# Altium schematic sheet APP_1_Connectors_e.SchDoc
size Tabloid; DocumentNumber: 3; SheetNumber: 3; SheetTotal: 12; Sheet_Name: Connectors; Size: 11x17
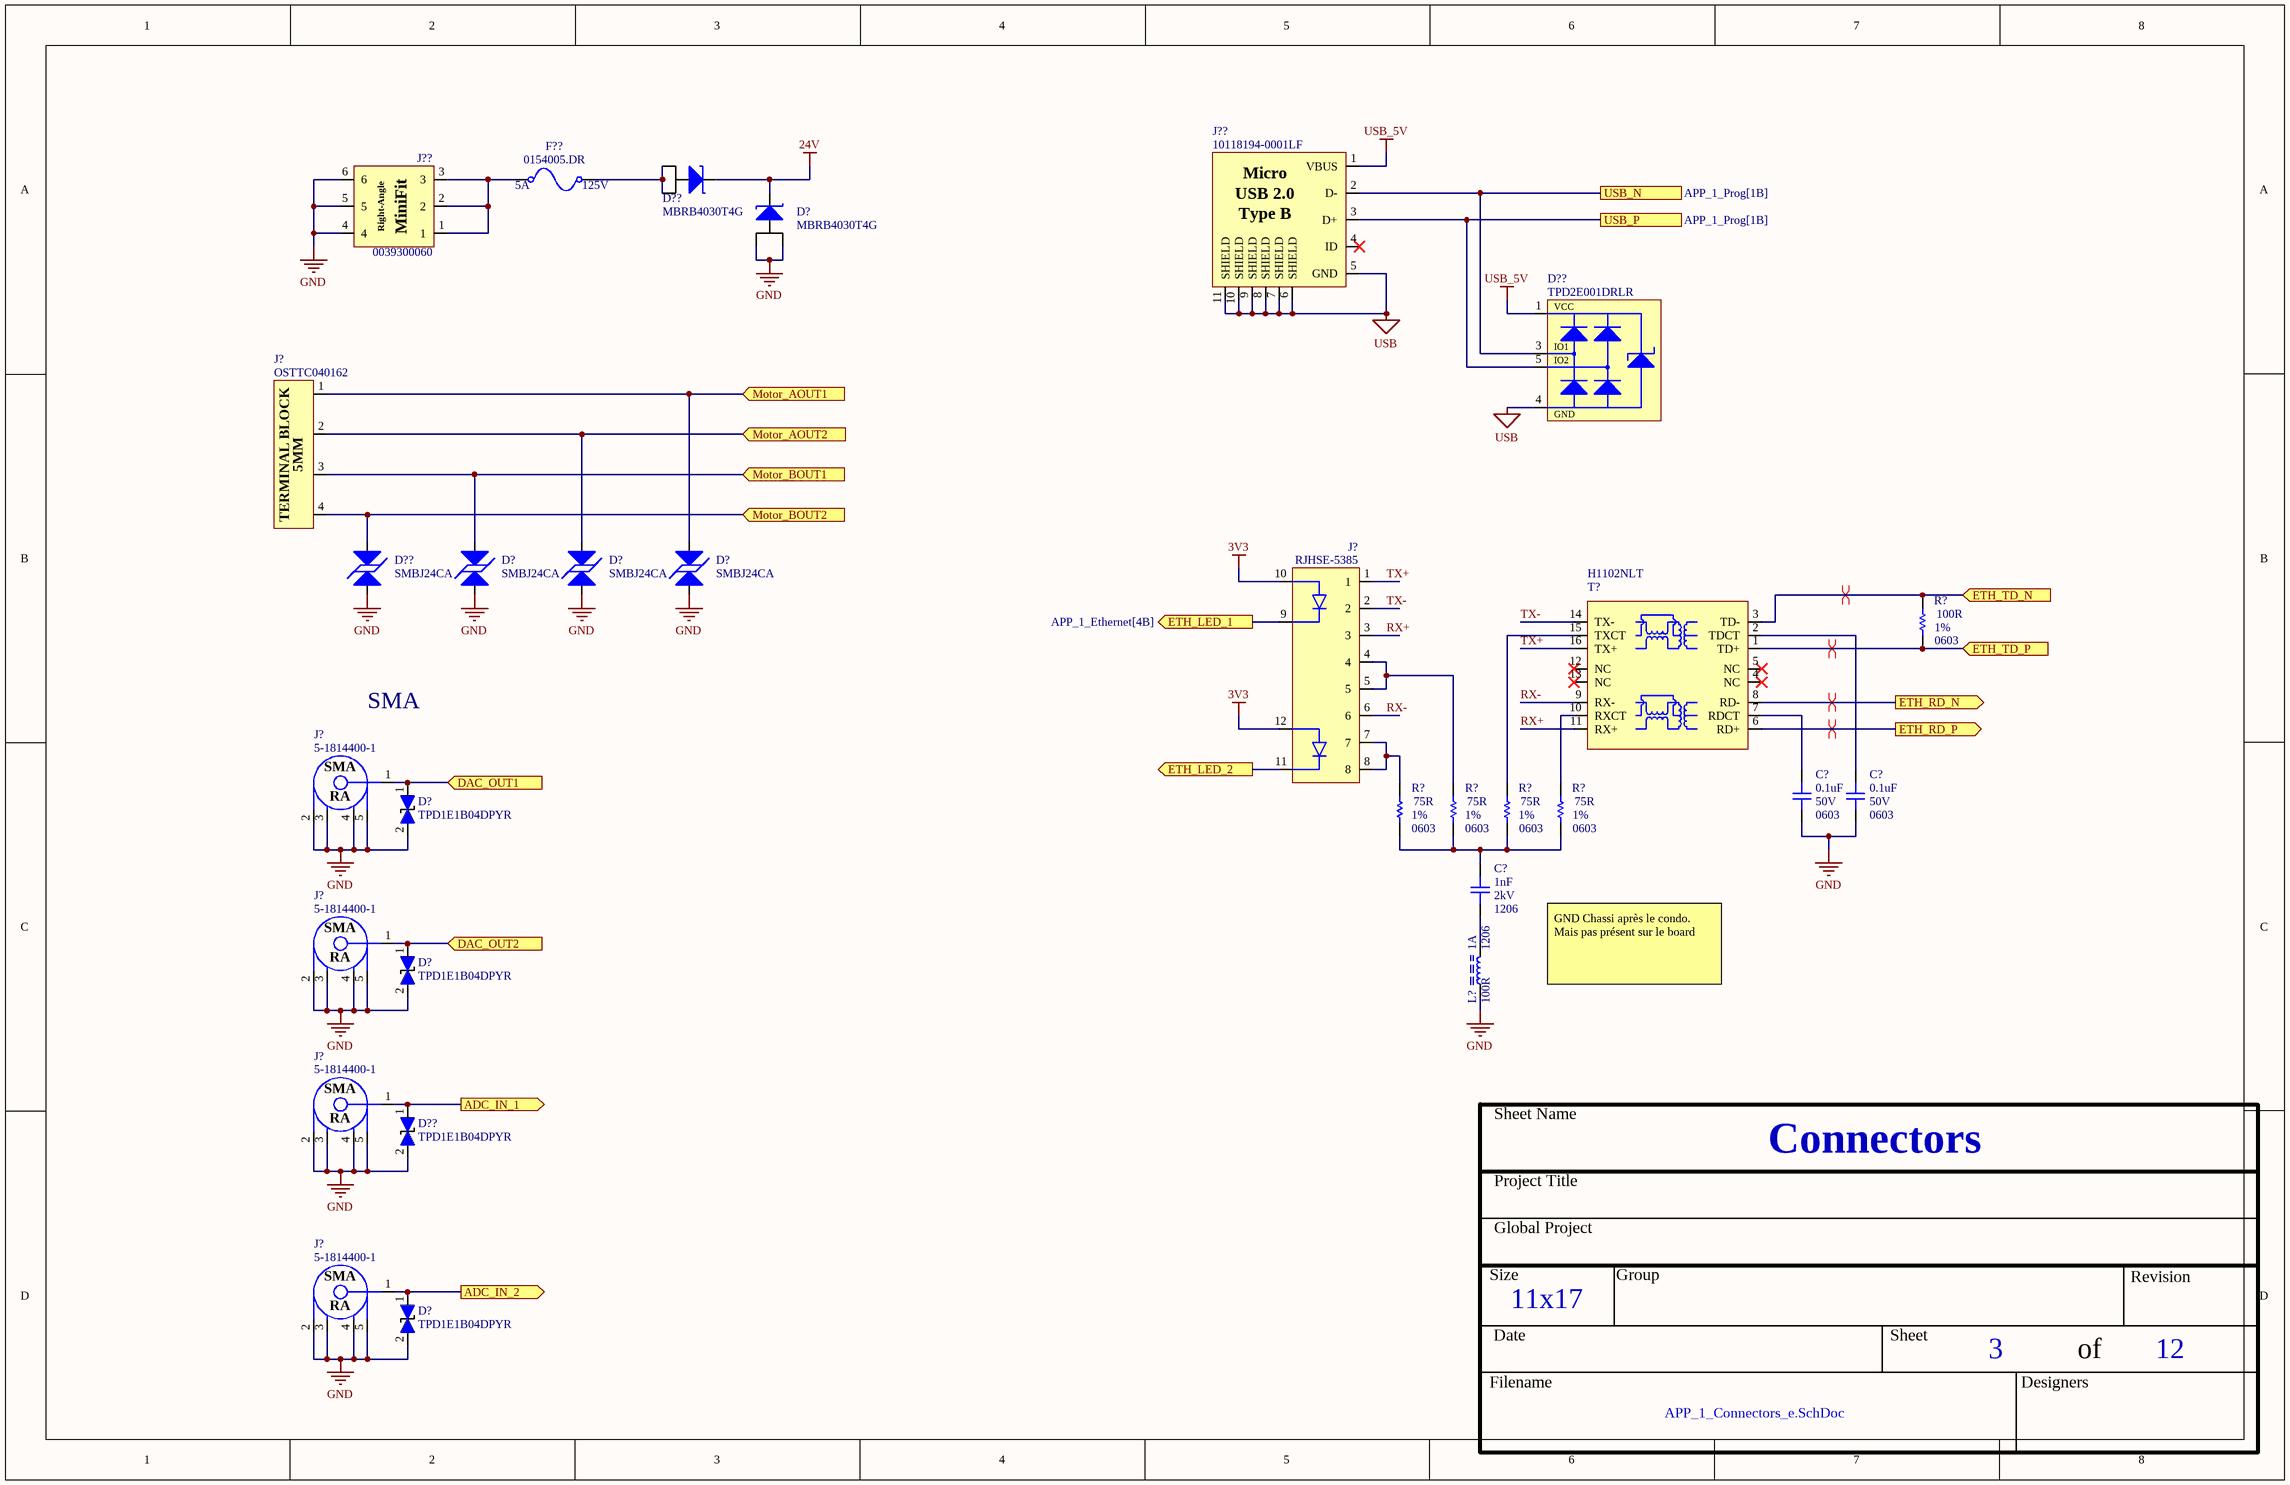
[diagram p0: APP_1_Connectors_e.SchDoc]

## Parts
(Parts that share a designator on the sheet are numbered #1, #2 ... from top to bottom, then left to right.)
C?#1  value 0.1uF  Voltage: 50V  Package: 0603  [CAP_0603]  (hidden comment: CAP - 0603)
C?#2  value 0.1uF  Voltage: 50V  Package: 0603  [CAP_0603]  (hidden comment: CAP - 0603)
C?#3  value 1nF  Voltage: 2kV  Package: 1206  [CAP_1206]  (hidden comment: CAP - 1206)
D?#1  MBRB4030T4G  [DIO_SCHOTTKY_MBRB4030T4G]
D?#2  SMBJ24CA  [TVS_PWR_SMBJ36CA]
D?#3  SMBJ24CA  [TVS_PWR_SMBJ36CA]
D?#4  SMBJ24CA  [TVS_PWR_SMBJ36CA]
D?#5  TPD1E1B04DPYR  [TVS_DATA_TPD1E1B04DPYR]
D?#6  TPD1E1B04DPYR  [TVS_DATA_TPD1E1B04DPYR]
D?#7  TPD1E1B04DPYR  [TVS_DATA_TPD1E1B04DPYR]
D??#1  MBRB4030T4G  [DIO_SCHOTTKY_MBRB4030T4G]
D??#2  TPD2E001DRLR  [TVS_USB_TPD2E001DRLR]
D??#3  SMBJ24CA  [TVS_PWR_SMBJ36CA]
D??#4  TPD1E1B04DPYR  [TVS_DATA_TPD1E1B04DPYR]
F??  0154005.DR  Voltage Rating: 125V  Current Rating: 5A  [FUS_0154XXX.DR]
J?#1  OSTTC040162  [CONN_TERMINAL_OSTTA040161]
J?#2  RJHSE-5385  [CONN_ETHERNET_RJHSE-5385]
J?#3  5-1814400-1  [CONN_SMA_5-1814400-1]
J?#4  5-1814400-1  [CONN_SMA_5-1814400-1]
J?#5  5-1814400-1  [CONN_SMA_5-1814400-1]
J?#6  5-1814400-1  [CONN_SMA_5-1814400-1]
J??#1  10118194-0001LF  [CON_USB_10118194-0001LF]
J??#2  0039300060  [CON_MINIFIT_0039300060]
L?  value 100R  Current: 1A  Package: 1206  [FER_1206]  (hidden comment: FER - 1206)
R?#1  value 100R  Package: 0603  Precision: 1%  [RES_0603]  (hidden comment: RES - 0603)
R?#2  value 75R  Package: 0603  Precision: 1%  [RES_0603]  (hidden comment: RES - 0603)
R?#3  value 75R  Package: 0603  Precision: 1%  [RES_0603]  (hidden comment: RES - 0603)
R?#4  value 75R  Package: 0603  Precision: 1%  [RES_0603]  (hidden comment: RES - 0603)
R?#5  value 75R  Package: 0603  Precision: 1%  [RES_0603]  (hidden comment: RES - 0603)
T?  H1102NLT  [TRANSFO_H1102NLT]

## Ports
ADC_IN_1 (out, see APP_1_ADC[1A]), ADC_IN_2 (out, see APP_1_ADC[1B]), DAC_OUT1 (in, see APP_1_DAC[5A]), DAC_OUT2 (in, see APP_1_DAC[5B]), ETH_LED_1 (out, see APP_1_Ethernet[4B]), ETH_LED_2 (out), ETH_RD_N (out, see APP_1_Ethernet[4B]), ETH_RD_P (out, see APP_1_Ethernet[4A]), ETH_TD_N (in, see APP_1_Ethernet[4A]), ETH_TD_P (in, see APP_1_Ethernet[4A]), Motor_AOUT1 (in, see APP_1_Stepper[5A]), Motor_AOUT2 (in, see APP_1_Stepper[5B]), Motor_BOUT1 (in, see APP_1_Stepper[5B]), Motor_BOUT2 (in, see APP_1_Stepper[5B]), USB_N (see APP_1_Prog[1B]), USB_P (see APP_1_Prog[1B])

## Nets
3V3: J?#2.10(LED1_A) J?#2.12(LED2_A)
24V: D?#1.4 D??#1.4
GND: C?#1.1 C?#2.1 D?#1.1(A) D?#1.3 D?#2.2 D?#3.2 D?#4.2 D?#5.2(i/o) D?#6.2(i/o) D?#7.2(i/o) D??#3.2 D??#4.2(i/o) J?#3.2 J?#3.3 J?#3.4 J?#3.5 J?#4.2 J?#4.3 J?#4.4 J?#4.5 J?#5.2 J?#5.3 J?#5.4 J?#5.5 J?#6.2 J?#6.3 J?#6.4 J?#6.5 J??#2.4 J??#2.5 J??#2.6 L?.2
USB: D??#2.4(GND) J??#1.5(GND) J??#1.6(SHIELD) J??#1.7(SHIELD) J??#1.8(SHIELD) J??#1.9(SHIELD) J??#1.10(SHIELD) J??#1.11(SHIELD)
USB_5V: D??#2.1(VCC) J??#1.1(VBUS)
ADC_IN_1: D??#4.1(i/o) J?#5.1 ; port ADC_IN_1
ADC_IN_2: D?#7.1(i/o) J?#6.1 ; port ADC_IN_2
DAC_OUT1: D?#5.1(i/o) J?#3.1 ; port DAC_OUT1
DAC_OUT2: D?#6.1(i/o) J?#4.1 ; port DAC_OUT2
ETH_LED_1: J?#2.9(LED1_K) ; port ETH_LED_1
ETH_LED_2: J?#2.11(LED2_K) ; port ETH_LED_2
ETH_RD_N: T?.8(RD-) ; port ETH_RD_N
ETH_RD_P: T?.6(RD+) ; port ETH_RD_P
ETH_TD_N: R?#1.2 T?.3(TD-) ; port ETH_TD_N
ETH_TD_P: R?#1.1 T?.1(TD+) ; port ETH_TD_P
Motor_AOUT1: D?#4.1 J?#1.1 ; port Motor_AOUT1
Motor_AOUT2: D?#3.1 J?#1.2 ; port Motor_AOUT2
Motor_BOUT1: D?#2.1 J?#1.3 ; port Motor_BOUT1
Motor_BOUT2: D??#3.1 J?#1.4 ; port Motor_BOUT2
RX+: J?#2.3 T?.11(RX+)
RX-: J?#2.6 T?.9(RX-)
TX+: J?#2.1 T?.16(TX+)
TX-: J?#2.2 T?.14(TX-)
USB_N: D??#2.3(IO1) J??#1.2(D-) ; port USB_N
USB_P: D??#2.5(IO2) J??#1.3(D+) ; port USB_P
NetC?#1_2: C?#1.2 T?.7(RDCT)
NetC?#2_2: C?#2.2 T?.2(TDCT)
NetC?#3_1: C?#3.1 L?.1
NetC?#3_2: C?#3.2 R?#2.1 R?#3.1 R?#4.1 R?#5.1
NetD??#1_1: D??#1.1(A) D??#1.3 F??.2
NetF??_1: F??.1 J??#2.1 J??#2.2 J??#2.3
NetJ?#2_4: J?#2.4 J?#2.5 R?#3.2
NetJ?#2_7: J?#2.7 J?#2.8 R?#2.2
NetR?#4_2: R?#4.2 T?.15(TXCT)
NetR?#5_2: R?#5.2 T?.10(RXCT)

Not connected (* = marked no-connect by the designer): D??#2 2(NC); J??#1 4(ID)*; T? 4(NC)* 5(NC)* 12(NC)* 13(NC)*

## Layout directives
differential pair: ETH_RD_N, ETH_RD_P, ETH_TD_N, ETH_TD_P

## Notes on the sheet
- SMA
- GND Chassi après le condo. Mais pas présent sur le board
- Sheet Name
- Project Title
- Global Project
- Size
- Group
- Revision
- Date
- Sheet
- of
- Filename
- Designers
- (in symbol CON_MINIFIT_0039300060) Right-Angle; MiniFit
- (in symbol CON_USB_10118194-0001LF) Micro; USB 2.0; Type B
- (in symbol CONN_SMA_5-1814400-1) SMA; RA
- (in symbol CONN_TERMINAL_OSTTC040162) TERMINAL BLOCK; 5MM

## Library data of the parts
C?#1 C?#2 = CAP - 0603: Precision: 10%; Current: *; CreatedBy: Jonathan Bouchard; Power: *
C?#3 = CAP - 1206: Precision: 10%; Current: *; CreatedBy: Jonathan Bouchard; Power: *
D?#1 D??#1 = DIO_SCHOTTKY_MBRB4030T4G: DIO - 30V MAX 40 A - TO-263-3; Manufacturer #1: ON Semiconductor; Value: Vf = 550mV @ 40A; Current Rating: 40A; GRAMS Lib Spec: 2.8; Magnetic Material: NO; Polarized: Yes; Cryo: UNKNOWN; Tolerance: *; Voltage Rating: 30V; Power Max: *; HelpURL: http://www.onsemi.com/pub/Collateral/MBRB4030-D.PDF; CreatedBy/Date: Arnaud Samson - 06/07/18; VerifiedBy: Jonathan Bouchard 2018-07-12; Temperature: -65°C ~ 175°C; Package: D2PAK; Manufacturer #2: *; Note: *; Assembly Type: SMD; Part Number #2: *; Part Number #1: MBRB4030T4G; Supplier 1: Digi-Key; Supplier Part Number 1: MBRB4030T4GOSCT-ND
D?#2-D?#4 D??#3 = TVS_PWR_SMBJ24CA: TVS - 24V 26.7V 600W - DO214AA; Manufacturer #1: Littelfuse Inc.; Value: Vbr = 26.7V -  Clamp = 38.9V; Voltage Rating: 24V Standoff; Current Rating: 15.5A; GRAMS Lib Spec: 2.8; Magnetic Material: UNKNOWN; Polarized: NO; Tolerance: *; Power Max: 600W; HelpURL: http://www.littelfuse.com/~/media/electronics/datasheets/tvs_diodes/littelfuse_tvs_diode_smbj_datasheet.pdf.pdf; CreatedBy/Date: Arnaud Samson - 06/07/18; VerifiedBy: Jonathan Bouchard - 2018-07-13; Temperature: -65°C ~ 150°C (TJ); Package: DO214AA; Manufacturer #2: *; Note: *; Assembly Type: SMD; Part Number #2: *; Part Number #1: SMBJ24CA; Supplier 1: Digi-Key; Supplier Part Number 1: SMBJ24CALFCT-ND; Cryo: UNKNOWN
D?#5-D?#7 D??#4 = TVS_DATA_TPD1E1B04DPYR: TVS - TVS DIODE 3.6V 8.5V - 0402; Manufacturer #1: Texas Instruments; Current Rating: 6.3Apeak; Power Max: 50Wpeak; GRAMS Lib Spec: 2.8; Magnetic Material: Unknown; Polarized: No; Value: *; Tolerance: *; Voltage Rating: 3.6V; HelpURL: http://www.ti.com/lit/ds/symlink/tpd1e1b04.pdf; CreatedBy/Date: Keven Deslandes - 2018/10/19; VerifiedBy: Caroline Paulin - 28 janv 2019; Temperature: -40°C ~ 125°C (TA); Package: 0402; Manufacturer #2: *; Note: *; Assembly Type: SMD; Part Number #2: *; Part Number #1: TPD1E1B04DPYR; Supplier 1: Digi-Key; Supplier Part Number 1: 296-47364-1-ND; Cryo: UNKNOWN
D??#2 = TVS_USB_TPD2E001DRLR: TVS - USB TVS DIODE 5.5V - SOT-553; Manufacturer #1: Texas Instruments; Value: 11V Breakdown; Voltage Rating: 5.5V (Max); GRAMS Lib Spec: 2.8; Magnetic Material: YES; Cryo: UNKNOWN; Tolerance: *; Current Rating: *; Power Max: *; HelpURL: http://www.ti.com/lit/ds/symlink/tpd2e001.pdf; CreatedBy/Date: Jonathan Bouchard 2018-07-10; VerifiedBy: Arnaud Samson 16-07-18; Temperature: -40°C ~ 85°C (TA); Package: SOT-553; Manufacturer #2: *; Note: *; Assembly Type: SMD; Part Number #2: *; Part Number #1: TPD2E001DRLR; Polarized: YES; Supplier 1: Digi-Key; Supplier Part Number 1: 296-21883-1-ND
F?? = FUS_0154005.DR: FUS - 5 A 125 VAC/VDC - 2-SMD; Manufacturer #1: Littelfuse Inc.; Value: 5A 125V AC/DC FAST; GRAMS Lib Spec: 2.8; Magnetic Material: UNKNOWN; Polarized: NO; Tolerance: *; Power Max: *; HelpURL: http://www.littelfuse.com/~/media/electronics/datasheets/fuses/littelfuse_fuse_154_154t_154l_154tl_datasheet.pdf.pdf; CreatedBy/Date: Arnaud Samson - 06/07/18; VerifiedBy: Jonathan Bouchard 2018-07-16; Temperature: -55°C ~ 125°C; Package: 2-SMD; Manufacturer #2: *; Note: *; Assembly Type: SMD; Part Number #2: *; Part Number #1: 0154005.DR; Supplier 1: Digi-Key; Supplier Part Number 1: F1228CT-ND; Cryo: UNKNOWN
J?#1 = CONN_TERMINAL_OSTTC040162: CONN -  TERMINAL BLOCK 4POS 5MM - TH; Mfg: On Shore Technology Inc.; Voltage: *; Current: *; Power: *; Mfg Part Number: OSTTC040162; HelpURL: http://www.on-shore.com/wp-content/uploads/2015/09/osttcxx0162.pdf; CreatedBy: Jonathan Bouchard; Temperature: -30°C ~ 105°C; Value: *; Precision: *; Package: TH-4; Supplier 1: Digikey; Supplier Part Number 1: ED2602-ND
J?#2 = CONN_ETHERNET_RJHSE-5385: CONN - MOD JACK RJ45 R/A ETHERNET - TH; Mfg: Amphenol; Voltage: *; Current: *; Power: *; Mfg Part Number: RJHSE-5385; HelpURL: https://www.amphenolcanada.com/ProductSearch/drawings/AC/RJHSE538X.pdf; CreatedBy: Jonathan Bouchard; Temperature: -55°C ~ 85°C; Value: *; Precision: *; Package: TH-12; Supplier 1: Digikey; Supplier Part Number 1: RJHSE-5385-ND
J?#3-J?#6 = CONN_SMA_5-1814400-1: CONN -  SMA JACK R/A 50 OHM - TH; Mfg: TE Connectivity AMP Connectors; Voltage: *; Current: *; Power: *; Mfg Part Number: 5-1814400-1; HelpURL: http://www.te.com/commerce/DocumentDelivery/DDEController?Action=srchrtrv&DocNm=1814400&DocType=Customer+Drawing&DocLang=English; CreatedBy: Jonathan Bouchard; Temperature: -55°C ~ 85°C; Value: *; Precision: *; Package: TH-5; Supplier 1: Digikey; Supplier Part Number 1: A97593-ND
J??#1 = CON_USB_10118194-0001LF: CON - USB MICRO B RECPT SMT R/A - 4PIN; Manufacturer #1: Amphenol FCI; Value: USB - Micro B; Voltage Rating: 100VAC; Current Rating: 1.8A; GRAMS Lib Spec: 2.8; Magnetic Material: YES; Cryo: UNKNOWN; Tolerance: *; Power Max: *; HelpURL: https://cdn.amphenol-icc.com/media/wysiwyg/files/drawing/10118194.pdf; CreatedBy/Date: Arnaud Samson - 09/07/18; VerifiedBy: Jonathan Bouchard 2018-07-12; Temperature: -30°C ~ 80°C; Package: 5-SMD; Manufacturer #2: *; Note: *; Assembly Type: SMD; Part Number #2: *; Part Number #1: 10118194-0001LF; Polarized: YES; Supplier 1: Digi-Key; Supplier Part Number 1: 609-4618-1-ND
J??#2 = CON_MINIFIT_0039300060: CON - Mini-Fit Through Hole, Right Angle 6 position; Manufacturer #1: Molex; Current Rating: 8A; GRAMS Lib Spec: 2.8; Magnetic Material: Unknown; Polarized: Yes; Voltage Rating: 600V; Assembly Type: TH; CreatedBy/Date: Joel Lemay 2018-06-21; HelpURL: https://www.molex.com/pdm_docs/sd/039300060_sd.pdf; Manufacturer #2: *; Package: TH; Part Number #1: 0039300060; Part Number #2: *; Power Max: *; Supplier 1: Digi-Key; Supplier Part Number 1: WM21353-ND; Temperature: - 40°C to + 80°C; Tolerance: *; Value: *; VerifiedBy: Caroline Paulin - 10 sept 2018; Cryo: UNKNOWN
T? = TRANSFO_H1102NLT: TRANSFO - ETHERNET 10/100B-TX - SMD-16; Mfg: Pulse Eng.; Value: 1:1 (350uH); Voltage: *; Current: *; Power: *; Mfg Part Number: H1102NLT; HelpURL: http://media.digikey.com/pdf/Data%20Sheets/Pulse%20PDFs/10_100BASE-T%20Single%20Port%20SMD%20Magnetics_Rev2008.pdf; CreatedBy: Jonathan Bouchard; Temperature: -40°C to 85°C; Precision: *; Package: SMD-16; Supplier 1: Digikey; Supplier Part Number 1: 553-1532-1-ND
L? = FER - 1206: Voltage: *; CreatedBy: Jonathan Bouchard; Power: *; Precision: *
R?#1-R?#5 = RES - 0603: Current: *; CreatedBy: Jonathan Bouchard